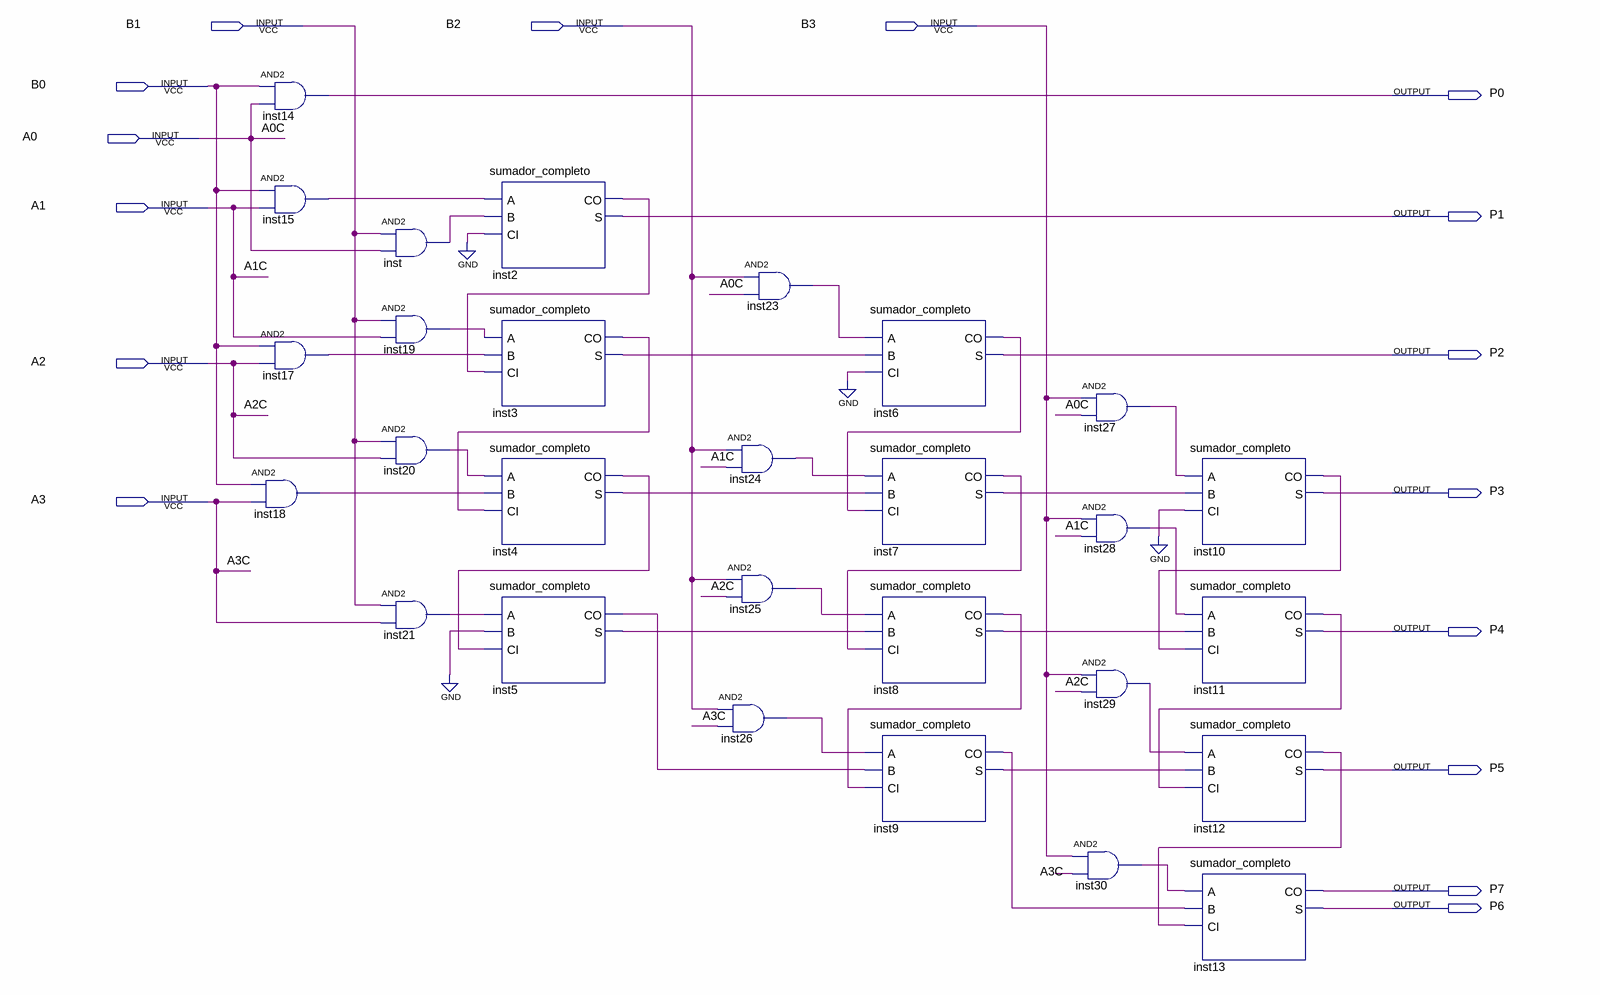
[diagram p0: schematic sheet]
// Quartus schematic MultiB.bdf as structural Verilog: 28 symbols, 16 pins
module MultiB (
  input  B1,
  input  B2,
  input  B3,
  input  B0,
  input  A0,
  input  A1,
  input  A2,
  input  A3,
  output P0,
  output P1,
  output P2,
  output P3,
  output P4,
  output P5,
  output P7,
  output P6
);

  wire inst2_co, inst3_co, inst3_s, inst4_co, inst4_s, inst5_co, inst5_s, inst6_co, inst7_co, inst7_s,
       inst8_co, inst8_s, inst9_co, inst9_s, inst10_co, inst11_co, inst12_co, inst15_out, inst17_out,
       inst18_out, inst19_out, inst20_out, inst21_out, inst23_out, inst24_out, inst25_out, inst26_out,
       inst27_out, inst28_out, inst29_out, inst30_out, inst_out;

  and inst14 (P0, B0, A0);
  and inst15 (inst15_out, B0, A1);
  and inst17 (inst17_out, B0, A2);
  and inst18 (inst18_out, B0, A3);
  and inst (inst_out, B1, A0);
  and inst19 (inst19_out, B1, A1);
  and inst20 (inst20_out, B1, A2);
  and inst21 (inst21_out, B1, A3);
  sumador_completo inst2 (.A(inst15_out), .B(inst_out), .CI(1'b0), .CO(inst2_co), .S(P1));
  sumador_completo inst3 (.A(inst19_out), .B(inst17_out), .CI(inst2_co), .CO(inst3_co), .S(inst3_s));
  sumador_completo inst4 (.A(inst20_out), .B(inst18_out), .CI(inst3_co), .CO(inst4_co), .S(inst4_s));
  sumador_completo inst5 (.A(inst21_out), .B(1'b0), .CI(inst4_co), .CO(inst5_co), .S(inst5_s));
  and inst23 (inst23_out, B2, A0);
  and inst24 (inst24_out, B2, A1);
  and inst25 (inst25_out, B2, A2);
  and inst26 (inst26_out, B2, A3);
  sumador_completo inst6 (.A(inst23_out), .B(inst3_s), .CI(1'b0), .CO(inst6_co), .S(P2));
  sumador_completo inst7 (.A(inst24_out), .B(inst4_s), .CI(inst6_co), .CO(inst7_co), .S(inst7_s));
  sumador_completo inst8 (.A(inst25_out), .B(inst5_s), .CI(inst7_co), .CO(inst8_co), .S(inst8_s));
  sumador_completo inst9 (.A(inst26_out), .B(inst5_co), .CI(inst8_co), .CO(inst9_co), .S(inst9_s));
  and inst27 (inst27_out, B3, A0);
  and inst28 (inst28_out, B3, A1);
  and inst29 (inst29_out, B3, A2);
  and inst30 (inst30_out, B3, A3);
  sumador_completo inst10 (.A(inst27_out), .B(inst7_s), .CI(1'b0), .CO(inst10_co), .S(P3));
  sumador_completo inst11 (.A(inst28_out), .B(inst8_s), .CI(inst10_co), .CO(inst11_co), .S(P4));
  sumador_completo inst12 (.A(inst29_out), .B(inst9_s), .CI(inst11_co), .CO(inst12_co), .S(P5));
  sumador_completo inst13 (.A(inst30_out), .B(inst9_co), .CI(inst12_co), .CO(P7), .S(P6));

  // Other names for the same wires on the sheet: A0C = A0; A1C = A1; A2C = A2; A3C = A3
endmodule
